# EAGLE design MCP23017_I16_v1_0 (EAGLE 9.6.2)
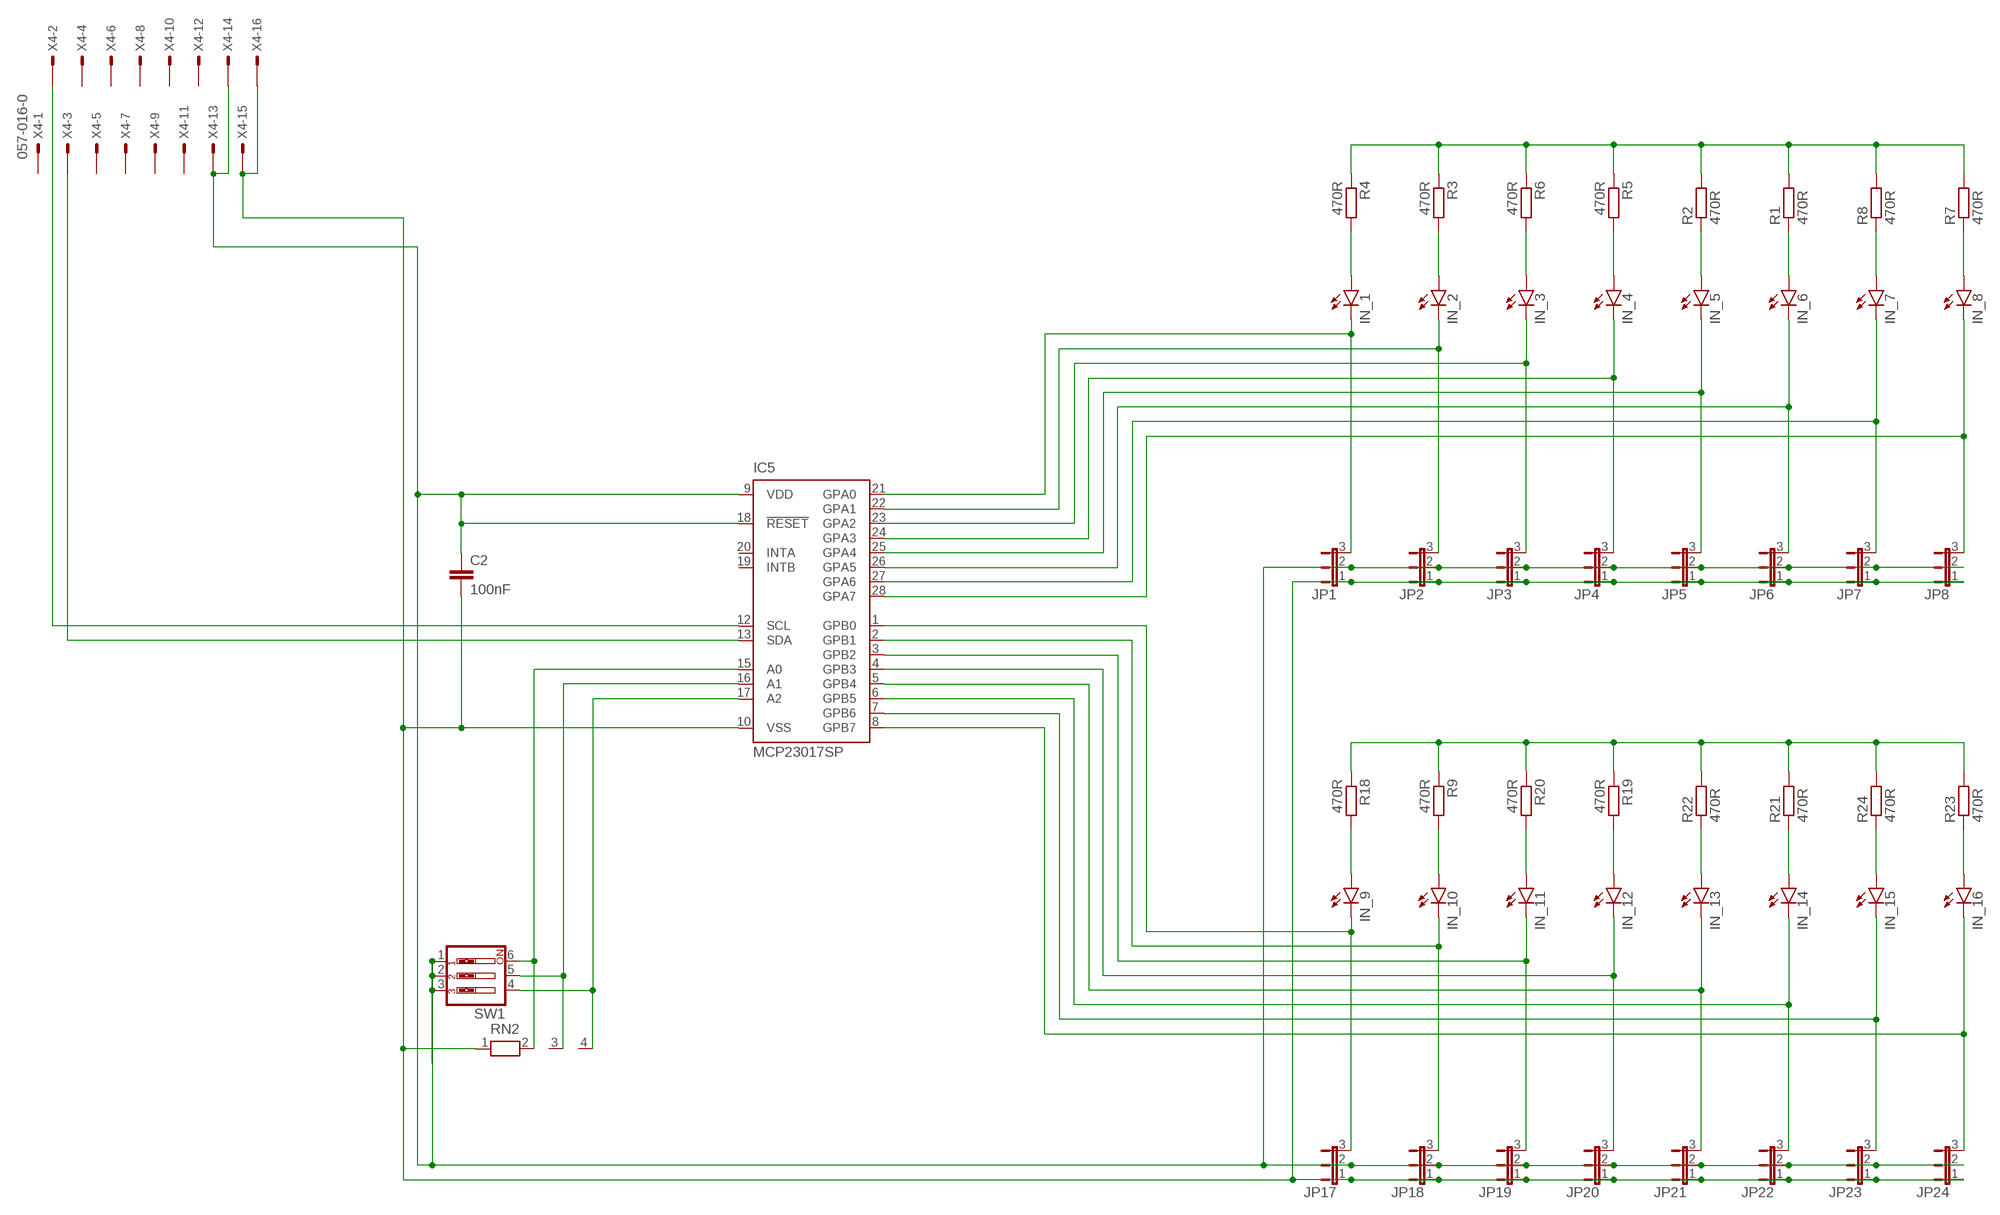
[diagram p0: schematic, sheet 1]

## Parts
C2  100nF  C-EU025-024X044  [C025-024X044]
IC5  MCP23017SP  [DIL28-3]
IN_1  LED3MM  [LED3MM]
IN_2  LED3MM  [LED3MM]
IN_3  LED3MM  [LED3MM]
IN_4  LED3MM  [LED3MM]
IN_5  LED3MM  [LED3MM]
IN_6  LED3MM  [LED3MM]
IN_7  LED3MM  [LED3MM]
IN_8  LED3MM  [LED3MM]
IN_9  LED3MM  [LED3MM]
IN_10  LED3MM  [LED3MM]
IN_11  LED3MM  [LED3MM]
IN_12  LED3MM  [LED3MM]
IN_13  LED3MM  [LED3MM]
IN_14  LED3MM  [LED3MM]
IN_15  LED3MM  [LED3MM]
IN_16  LED3MM  [LED3MM]
JP1  JP2E  [JP2]
JP2  JP2E  [JP2]
JP3  JP2E  [JP2]
JP4  JP2E  [JP2]
JP5  JP2E  [JP2]
JP6  JP2E  [JP2]
JP7  JP2E  [JP2]
JP8  JP2E  [JP2]
JP17  JP2E  [JP2]
JP18  JP2E  [JP2]
JP19  JP2E  [JP2]
JP20  JP2E  [JP2]
JP21  JP2E  [JP2]
JP22  JP2E  [JP2]
JP23  JP2E  [JP2]
JP24  JP2E  [JP2]
R1  470R  R-EU_0309/10  [0309/10]
R2  470R  R-EU_0309/10  [0309/10]
R3  470R  R-EU_0309/10  [0309/10]
R4  470R  R-EU_0309/10  [0309/10]
R5  470R  R-EU_0309/10  [0309/10]
R6  470R  R-EU_0309/10  [0309/10]
R7  470R  R-EU_0309/10  [0309/10]
R8  470R  R-EU_0309/10  [0309/10]
R9  470R  R-EU_0309/10  [0309/10]
R18  470R  R-EU_0309/10  [0309/10]
R19  470R  R-EU_0309/10  [0309/10]
R20  470R  R-EU_0309/10  [0309/10]
R21  470R  R-EU_0309/10  [0309/10]
R22  470R  R-EU_0309/10  [0309/10]
R23  470R  R-EU_0309/10  [0309/10]
R24  470R  R-EU_0309/10  [0309/10]
RN2  RN03  [RN-3]
SW1  SW_DIP-3  [EDG-03]
X4  057-016-0  [057-016-0]

## Nets
GND1: C2.2 IC5.10(VSS) JP1.1 JP2.1 JP3.1 JP4.1 JP5.1 JP6.1 JP7.1 JP8.1 JP17.1 JP18.1 JP19.1 JP20.1 JP21.1 JP22.1 JP23.1 JP24.1 RN2.1 X4.15 X4.16
N$1: IC5.21(GPA0) IN_1.K(C) JP1.3
N$2: IC5.15(A0) RN2.2 SW1.6
N$3: IC5.23(GPA2) IN_3.K(C) JP3.3
N$5: IC5.25(GPA4) IN_5.K(C) JP5.3
N$6: IC5.17(A2) RN2.4 SW1.4
N$8: IC5.27(GPA6) IN_7.K(C) JP7.3
N$10: IN_8.A R7.1
N$11: IN_7.A R8.1
N$13: IN_6.A R1.1
N$22: IC5.22(GPA1) IN_2.K(C) JP2.3
N$24: IC5.24(GPA3) IN_4.K(C) JP4.3
N$26: IC5.26(GPA5) IN_6.K(C) JP6.3
N$28: IC5.28(GPA7) IN_8.K(C) JP8.3
N$29: IN_5.A R2.1
N$30: IN_4.A R5.2
N$31: IN_3.A R6.2
N$32: IN_2.A R3.2
N$33: IN_1.A R4.2
N$35: IC5.16(A1) RN2.3 SW1.5
N$36: IC5.1(GPB0) IN_9.K(C) JP17.3
N$38: IC5.3(GPB2) IN_11.K(C) JP19.3
N$42: IC5.5(GPB4) IN_13.K(C) JP21.3
N$50: IC5.2(GPB1) IN_10.K(C) JP18.3
N$52: IC5.4(GPB3) IN_12.K(C) JP20.3
N$53: IC5.7(GPB6) IN_15.K(C) JP23.3
N$56: IC5.6(GPB5) IN_14.K(C) JP22.3
N$58: IC5.8(GPB7) IN_16.K(C) JP24.3
N$59: IN_16.A R23.1
N$60: IN_15.A R24.1
N$61: IN_14.A R21.1
N$62: IN_13.A R22.1
N$63: IN_12.A R19.2
N$64: IN_11.A R20.2
N$65: IN_10.A R9.2
N$66: IN_9.A R18.2
N$82: IC5.12(SCL) X4.2
N$84: IC5.13(SDA) X4.3
VCC5.2: C2.1 IC5.9(VDD) IC5.18(!RESET) JP1.2 JP2.2 JP3.2 JP4.2 JP5.2 JP6.2 JP7.2 JP8.2 JP17.2 JP18.2 JP19.2 JP20.2 JP21.2 JP22.2 JP23.2 JP24.2 R1.2 R2.2 R3.1 R4.1 R5.1 R6.1 R7.2 R8.2 R9.1 R18.1 R19.1 R20.1 R21.2 R22.2 R23.2 R24.2 SW1.1 SW1.2 SW1.3 X4.13 X4.14
Unconnected: IC5.19(INTB) IC5.20(INTA) X4.1 X4.4 X4.5 X4.6 X4.7 X4.8 X4.9 X4.10 X4.11 X4.12

## Library data of the parts
C2 = resistor:C-EU: CAPACITOR, European symbol
IC5 = microchip-6:MCP23017: http://ww1.microchip.com/downloads/en/DeviceDoc/21952a.pdf Source: http://ww1.microchip.com/downloads/en/DeviceDoc/21952a.pdf
IN_1-IN_16 = led:LED: LED OSRAM: - CHIPLED LG R971, LG N971, LY N971, LG Q971, LY Q971, LO R971, LY R971 LH N974, LH R974 LS Q976, LO Q976, LY Q976 LO Q996 - Hyper CHIPLED LW Q18S LB Q993, LB Q99A, LB R99A - SideLED LS A670, LO A670, LY A670, LG A670, LP A670 LB A673, LV A673, LT A673, LW A673 LH A674 LY A675 LS A676, LA A676, LO A676, LY A676, LW A676 LS A679, LY A679, LG A679 - Hyper Micro SIDELED® LS Y876, LA Y876, LO Y876, LY Y876 LT Y87S - SmartLED LW L88C, LW L88S LB L89C, LB L89S, LG L890 LS L89K, LO L89K, LY L89K LS L896, LA L896, LO L896, LY L896 - TOPLED LS T670, LO T670, LY T670, LG T670, LP T670 LSG T670, LSP T670, LSY T670, LOP T670, LYG T670 LG T671, LOG T671, LSG T671 LB T673, LV T673, LT T673, LW T673 LH T674 LS T676, LA T676, LO T676, LY T676, LB T676, LH T676, LSB T676, LW T676 LB T67C, LV T67C, LT T67C, LS T67K, LO T67K, LY T67K, LW E67C LS E67B, LA E67B, LO E67B, LY E67B, LB E67C, LV E67C, LT E67C LW T67C LS T679, LY T679, LG T679 LS T770, LO T770, LY T770, LG T770, LP T770 LB T773, LV T773, LT T773, LW T773 LH T774 LS E675, LA E675, LY E675, LS T675 LS T776, LA T776, LO T776, LY T776, LB T776 LHGB T686 LT T68C, LB T68C - Hyper Mini TOPLED® LB M676 - Mini TOPLED Santana® LG M470 LS M47K, LO M47K, LY M47K Source: http://www.osram.convergy.de LUXEON: - LUMILED® LXK2-PW12-R00, LXK2-PW12-S00, LXK2-PW14-U00, LXK2-PW14-V00 LXK2-PM12-R00, LXK2-PM12-S00, LXK2-PM14-U00 LXK2-PE12-Q00, LXK2-PE12-R00, LXK2-PE12-S00, LXK2-PE14-T00, LXK2-PE14-U00 LXK2-PB12-K00, LXK2-PB12-L00, LXK2-PB12-M00, LXK2-PB14-N00, LXK2-PB14-P00, LXK2-PB14-Q00 LXK2-PR12-L00, LXK2-PR12-M00, LXK2-PR14-Q00, LXK2-PR14-R00 LXK2-PD12-Q00, LXK2-PD12-R00, LXK2-PD12-S00 LXK2-PH12-R00, LXK2-PH12-S00 LXK2-PL12-P00, LXK2-PL12-Q00, LXK2-PL12-R00 Source: www.luxeon.com KINGBRIGHT: KA-3528ASYC Source: www.kingbright.com
JP1-JP8 JP17-JP24 = jumper:JP2E: JUMPER
R1-R9 R18-R24 = resistor:R-EU_: RESISTOR, European symbol
RN2 = resistor-net_edit:RN03: RESISTOR NETWORK; OC_FARNELL: unknown; OC_NEWARK: unknown
SW1 = special:SW_DIP-3: DIP SWITCH
X4 = con-panduit:057-016-: CONNECTOR 10-pin series 057 contact pc board low profile headers; OC_FARNELL: unknown; OC_NEWARK: unknown

## Board
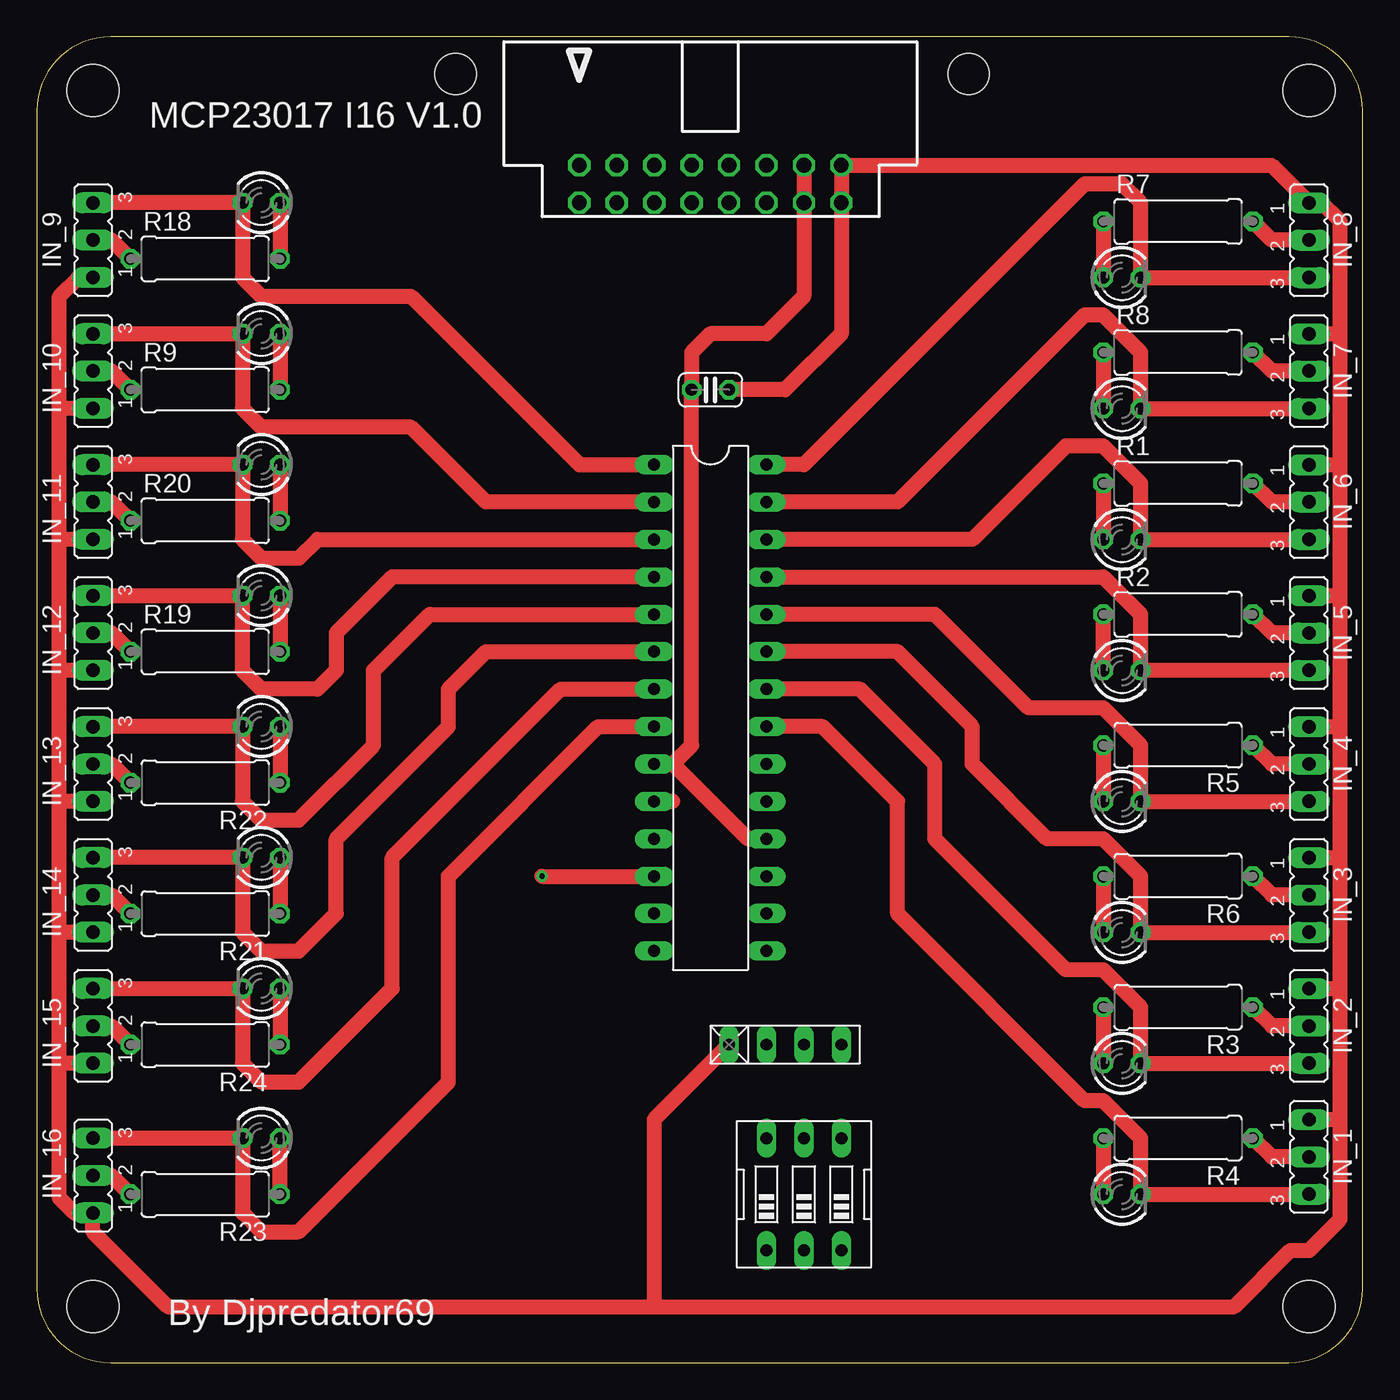
[diagram p1: board, top side]
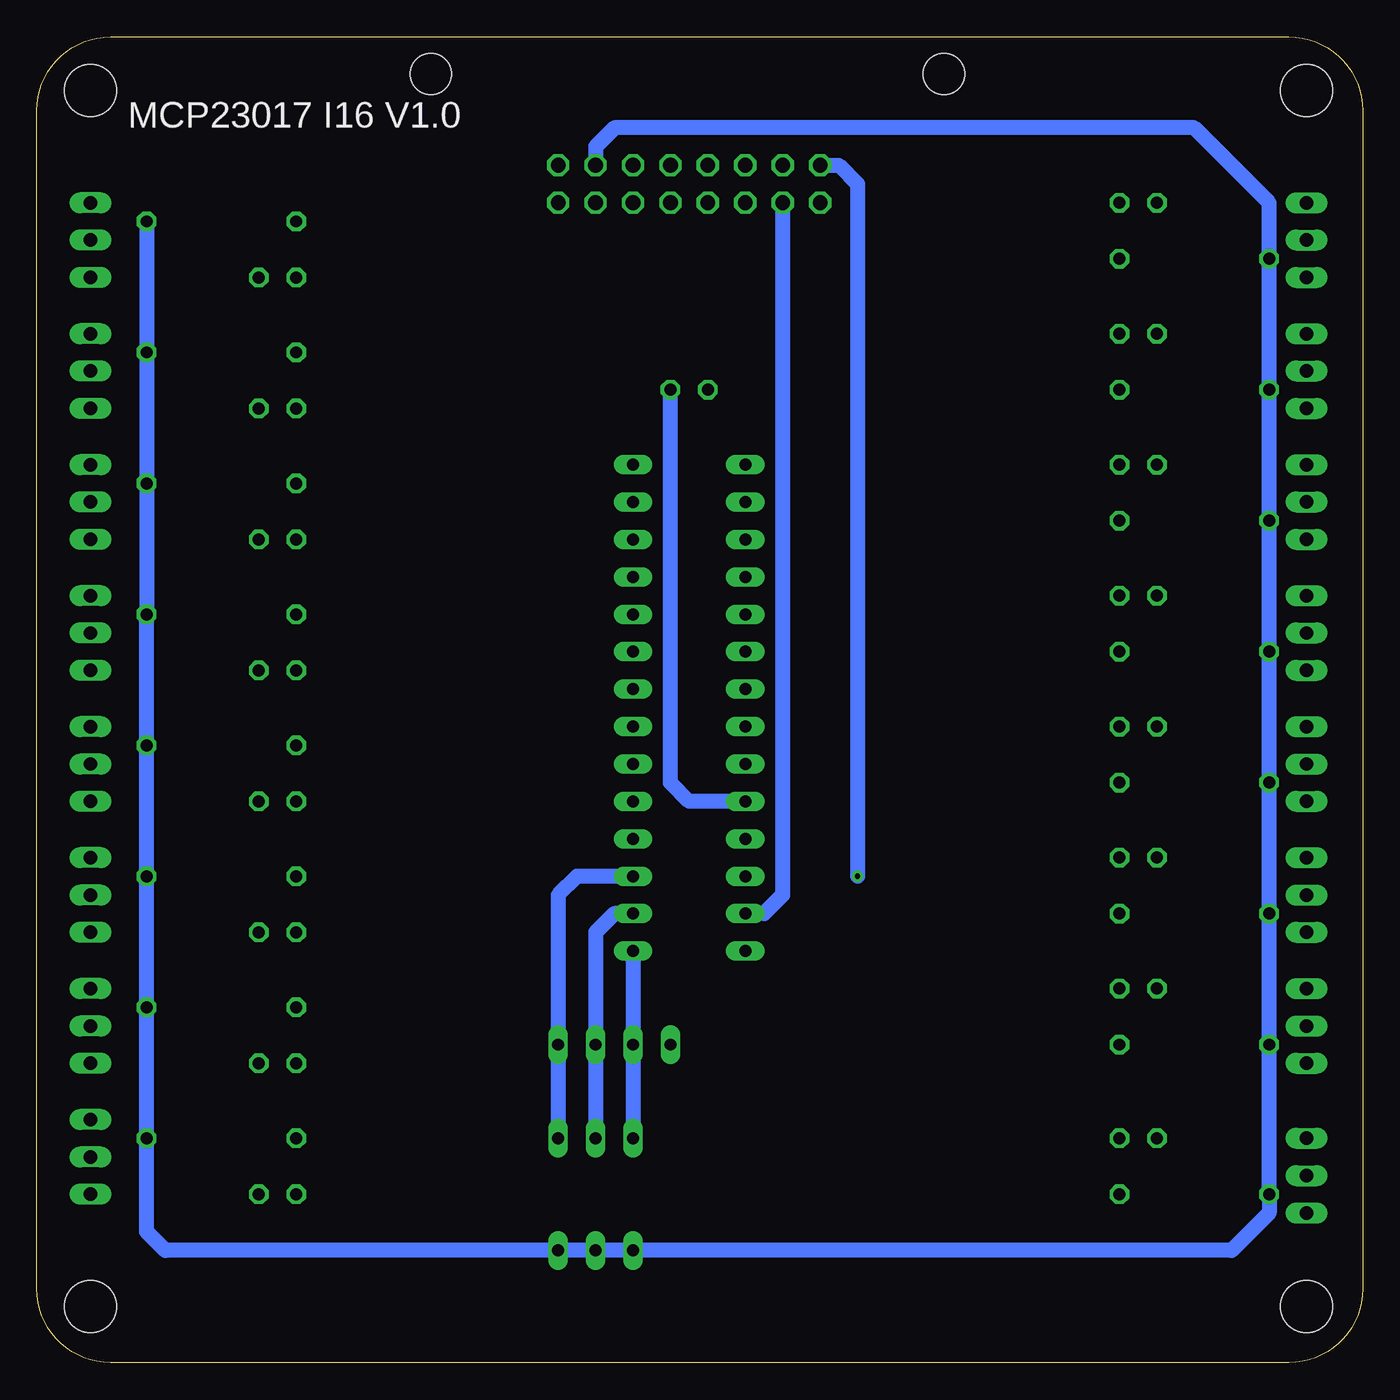
[diagram p2: board, bottom side, seen from below]

Size 90 x 90 mm. Coordinates in mm from the lower left corner, seen from the top.
Outline: 0,85 0,5 arc90 5,0 85,0 arc90 90,5 90,85 arc90 85,90 5,90 arc90 0,85
Copper layers (1*16): Top 0.035mm / dielectric 1.5mm / Bottom 0.035mm
Design rules "default": minimum track width 6mil, minimum drill 0.35mm, track to track 6mil, track to pad 6mil, pad to pad 6mil, via to via 6mil, smd to smd 6mil, copper to edge 40mil, drill to drill 6mil, minimum pad ring 10mil, minimum via ring 8mil, stop-mask expansion 4mil, vias tented up to drill 0mil, thermal gap 10mil
Holes 3.5 mm at 86.36,86.36 3.81,86.36 3.81,3.81 86.36,3.81

### Footprints (pad centres in the part's own frame; a part is rotated, then mirrored left to right if it is on the bottom)
C025-024X044 = drill 0.813 octagon: 1 -1.27,0; 2 1.27,0
DIL28-3 = drill 0.813 long: 1 -16.51,-3.81; 2 -13.97,-3.81; 3 -11.43,-3.81; 4 -8.89,-3.81; 5 -6.35,-3.81; 6 -3.81,-3.81; 7 -1.27,-3.81; 8 1.27,-3.81; 9 3.81,-3.81; 10 6.35,-3.81; 11 8.89,-3.81; 12 11.43,-3.81; 13 13.97,-3.81; 14 16.51,-3.81; 15 16.51,3.81; 16 13.97,3.81; 17 11.43,3.81; 18 8.89,3.81; 19 6.35,3.81; 20 3.81,3.81; 21 1.27,3.81; 22 -1.27,3.81; 23 -3.81,3.81; 24 -6.35,3.81; 25 -8.89,3.81; 26 -11.43,3.81; 27 -13.97,3.81; 28 -16.51,3.81
LED3MM = drill 0.813 octagon: A -1.27,0; K 1.27,0
JP2 = drill 0.914 long: 1 -2.54,0; 2 0,0; 3 2.54,0
0309/10 = drill 0.813 octagon: 1 -5.08,0; 2 5.08,0
RN-3 = drill 0.813 long: 1 -5.08,0; 2 -2.54,0; 3 0,0; 4 2.54,0
EDG-03 = drill 0.813 long: 1 -2.54,-3.81; 2 0,-3.81; 3 2.54,-3.81; 4 2.54,3.81; 5 0,3.81; 6 -2.54,3.81
057-016-0 = drill 1 octagon: 1 -8.89,-5.08; 2 -8.89,-2.54; 3 -6.35,-5.08; 4 -6.35,-2.54; 5 -3.81,-5.08; 6 -3.81,-2.54; 7 -1.27,-5.08; 8 -1.27,-2.54; 9 1.27,-5.08; 10 1.27,-2.54; 11 3.81,-5.08; 12 3.81,-2.54; 13 6.35,-5.08; 14 6.35,-2.54; 15 8.89,-5.08; 16 8.89,-2.54 | hole 2.8: -17.29,3.66; 17.54,3.66

### Placement (x,y rotation side)
C2  45.72,66.04 0 top
IC5  45.72,44.45 270 top
IN_1  73.66,11.43 0 top
IN_2  73.66,20.32 0 top
IN_3  73.66,29.21 0 top
IN_4  73.66,38.1 0 top
IN_5  73.66,46.99 0 top
IN_6  73.66,55.88 0 top
IN_7  73.66,64.77 0 top
IN_8  73.66,73.66 0 top
IN_9  15.24,78.74 180 top
IN_10  15.24,69.85 180 top
IN_11  15.24,60.96 180 top
IN_12  15.24,52.07 180 top
IN_13  15.24,43.18 180 top
IN_14  15.24,34.29 180 top
IN_15  15.24,25.4 180 top
IN_16  15.24,15.24 180 top
JP1  86.36,13.97 270 top
JP2  86.36,22.86 270 top
JP3  86.36,31.75 270 top
JP4  86.36,40.64 270 top
JP5  86.36,49.53 270 top
JP6  86.36,58.42 270 top
JP7  86.36,67.31 270 top
JP8  86.36,76.2 270 top
JP17  3.81,76.2 90 top
JP18  3.81,67.31 90 top
JP19  3.81,58.42 90 top
JP20  3.81,49.53 90 top
JP21  3.81,40.64 90 top
JP22  3.81,31.75 90 top
JP23  3.81,22.86 90 top
JP24  3.81,12.7 90 top
R1  77.47,59.69 0 top
R2  77.47,50.8 0 top
R3  77.47,24.13 180 top
R4  77.47,15.24 180 top
R5  77.47,41.91 180 top
R6  77.47,33.02 180 top
R7  77.47,77.47 0 top
R8  77.47,68.58 0 top
R9  11.43,66.04 0 top
R18  11.43,74.93 0 top
R19  11.43,48.26 0 top
R20  11.43,57.15 0 top
R21  11.43,30.48 180 top
R22  11.43,39.37 180 top
R23  11.43,11.43 180 top
R24  11.43,21.59 180 top
RN2  52.07,21.59 0 top
SW1  52.07,11.43 0 top
X4  45.72,83.82 0 top

### Tracks (layer width: path | path; a pad name or v marks a point on that pad's centre or on a via)
GND1
  Top 1.016: 1.52,20.32 1.52,29.21 | 1.52,29.21 1.52,38.1 | 1.52,38.1 1.52,46.99 | 1.52,46.99 1.52,55.88 | 1.52,55.88 1.52,64.77 | 1.52,64.77 1.52,72.39 2.79,73.66 JP17.1 | JP18.1 1.52,64.77 | JP20.1 1.52,46.99 | JP19.1 1.52,55.88 | JP21.1 1.52,38.1 | JP22.1 1.52,29.21 | JP23.1 1.52,20.32 | 1.52,20.32 1.52,11.18 2.54,10.16 JP24.1 3.81,8.89 8.89,3.81 41.91,3.81 | 41.91,3.81 81.28,3.81 85.09,7.62 86.36,7.62 88.48,9.74 88.48,16.51 | 88.48,16.51 88.48,25.4 | 88.48,25.4 88.48,34.29 | 88.48,34.29 88.48,43.18 | 88.48,43.18 88.48,52.07 | 88.48,52.07 88.48,60.96 | 88.48,60.96 88.48,69.85 | 88.48,69.85 88.48,77.47 87.21,78.74 JP8.1 83.82,81.28 X4.16 X4.15 54.61,69.85 50.8,66.04 C2.2 | JP1.1 88.48,16.51 | JP2.1 88.48,25.4 | JP7.1 88.48,69.85 | JP6.1 88.48,60.96 | JP5.1 88.48,52.07 | JP4.1 88.48,43.18 | JP3.1 88.48,34.29 | RN2.1 44.45,19.05 41.91,16.51 41.91,3.81 | IC5.10 43.18,38.1
  Bottom 1.016: IC5.10 45.72,38.1 46.99,39.37 C2.2
N$1
  Top 1.016: JP1.3 IN_1.K 74.93,15.24 72.39,17.78 71.12,17.78 58.42,30.48 58.42,38.1 53.34,43.18 IC5.21
N$2
  Bottom 1.016: SW1.6 RN2.2 IC5.15
N$3
  Top 1.016: JP3.3 IN_3.K 74.93,33.02 72.39,35.56 68.58,35.56 63.5,40.64 63.5,43.18 58.42,48.26 IC5.23
N$5
  Top 1.016: JP5.3 IN_5.K 74.93,50.8 72.39,53.34 IC5.25
N$6
  Bottom 1.016: SW1.4 RN2.4 54.61,31.75 53.34,33.02 IC5.17
N$8
  Top 1.016: JP7.3 IN_7.K 74.93,68.58 72.39,71.12 71.12,71.12 58.42,58.42 IC5.27
N$10
  Top 1.016: R7.1 IN_8.A
N$11
  Top 1.016: R8.1 IN_7.A
N$13
  Top 1.016: R1.1 IN_6.A
N$22
  Top 1.016: JP2.3 IN_2.K 74.93,24.13 72.39,26.67 69.85,26.67 60.96,35.56 60.96,40.64 55.88,45.72 IC5.22
N$24
  Top 1.016: JP4.3 IN_4.K 74.93,41.91 72.39,44.45 67.31,44.45 60.96,50.8 IC5.24
N$26
  Top 1.016: JP6.3 IN_6.K 74.93,59.69 72.39,62.23 69.85,62.23 63.5,55.88 IC5.26
N$28
  Top 1.016: JP8.3 IN_8.K 74.93,78.74 73.66,80.01 71.12,80.01 52.07,60.96 IC5.28
N$29
  Top 1.016: IN_5.A R2.1
N$30
  Top 1.016: R5.2 IN_4.A
N$31
  Top 1.016: R6.2 IN_3.A
N$32
  Top 1.016: R3.2 IN_2.A
N$33
  Top 1.016: R4.2 IN_1.A
N$35
  Bottom 1.016: SW1.5 RN2.3 52.07,29.21 50.8,30.48 IC5.16
N$36
  Top 1.016: JP17.3 IN_9.K 13.97,73.66 15.24,72.39 25.4,72.39 36.83,60.96 IC5.1
N$38
  Top 1.016: JP19.3 IN_11.K 13.97,55.88 15.24,54.61 17.78,54.61 19.05,55.88 IC5.3
N$42
  Top 1.016: JP21.3 IN_13.K 13.97,38.1 15.24,36.83 17.78,36.83 22.86,41.91 22.86,46.99 26.67,50.8 IC5.5
N$50
  Top 1.016: JP18.3 IN_10.K 13.97,64.77 15.24,63.5 25.4,63.5 30.48,58.42 IC5.2
N$52
  Top 1.016: JP20.3 IN_12.K 13.97,46.99 15.24,45.72 19.05,45.72 20.32,46.99 20.32,49.53 24.13,53.34 IC5.4
N$53
  Top 1.016: JP23.3 IN_15.K 13.97,20.32 15.24,19.05 17.78,19.05 24.13,25.4 24.13,34.29 35.56,45.72 IC5.7
N$56
  Top 1.016: JP22.3 IN_14.K 13.97,29.21 15.24,27.94 17.78,27.94 20.32,30.48 20.32,35.56 27.94,43.18 27.94,45.72 30.48,48.26 IC5.6
N$58
  Top 1.016: JP24.3 IN_16.K 13.97,10.16 15.24,8.89 17.78,8.89 27.94,19.05 27.94,33.02 38.1,43.18 IC5.8
N$59
  Top 1.016: R23.1 IN_16.A
N$60
  Top 1.016: IN_15.A R24.1
N$61
  Top 1.016: IN_14.A R21.1
N$62
  Top 1.016: IN_13.A R22.1
N$63
  Top 1.016: IN_12.A R19.2
N$64
  Top 1.016: IN_11.A R20.2
N$65
  Top 1.016: IN_10.A R9.2
N$66
  Top 1.016: IN_9.A R18.2
N$82  (via drill 0.35)
  Top 1.016: v34.29,33.02 IC5.12
  Bottom 1.016: X4.2 35.56,81.28 34.29,80.01 v34.29,33.02
N$84
  Bottom 1.016: X4.3 39.37,31.75 40.64,30.48 IC5.13
VCC5.2
  Top 1.016: JP17.2 5.08,76.2 R18.1 | JP18.2 5.08,67.31 R9.1 | JP19.2 5.08,58.42 R20.1 | JP20.2 5.08,49.53 R19.1 | JP24.2 5.08,12.7 R23.2 | JP23.2 5.08,22.86 R24.2 | R21.2 5.08,31.75 JP22.2 | JP21.2 5.08,40.64 R22.2 | JP8.2 83.82,76.2 R7.2 | JP7.2 83.82,67.31 R8.2 | JP6.2 83.82,58.42 R1.2 | JP5.2 83.82,49.53 R2.2 | JP1.2 83.82,13.97 R4.1 | JP2.2 83.82,22.86 R3.1 | JP3.2 83.82,31.75 R6.1 | JP4.2 83.82,40.64 R5.1 | X4.14 X4.13 52.07,72.39 49.53,69.85 45.72,69.85 44.45,68.58 C2.1 44.45,41.91 43.18,40.64 | IC5.9 43.18,40.64 | IC5.18 48.26,35.56 43.18,40.64
  Bottom 1.016: X4.14 52.07,82.55 50.8,83.82 11.43,83.82 6.35,78.74 R18.1 R9.1 R20.1 R19.1 R22.2 R21.2 R24.2 R23.2 6.35,10.16 8.89,7.62 SW1.1 SW1.2 SW1.3 81.28,7.62 82.55,8.89 R4.1 R3.1 R6.1 R5.1 R2.2 R1.2 R8.2 R7.2

### Text on the board
tNames: MCP23017 I16 V1.0 | By Djpredator69
bNames: MCP23017 I16 V1.0